# EasyEDA Pro project 平衡车主板.eprj, schematic Schematic1
Board Name: Board1; Create Date: 2025-03-17; Company: 自动化科协; Drawed: Mr_Pian; Reviewed: Mr_Pian
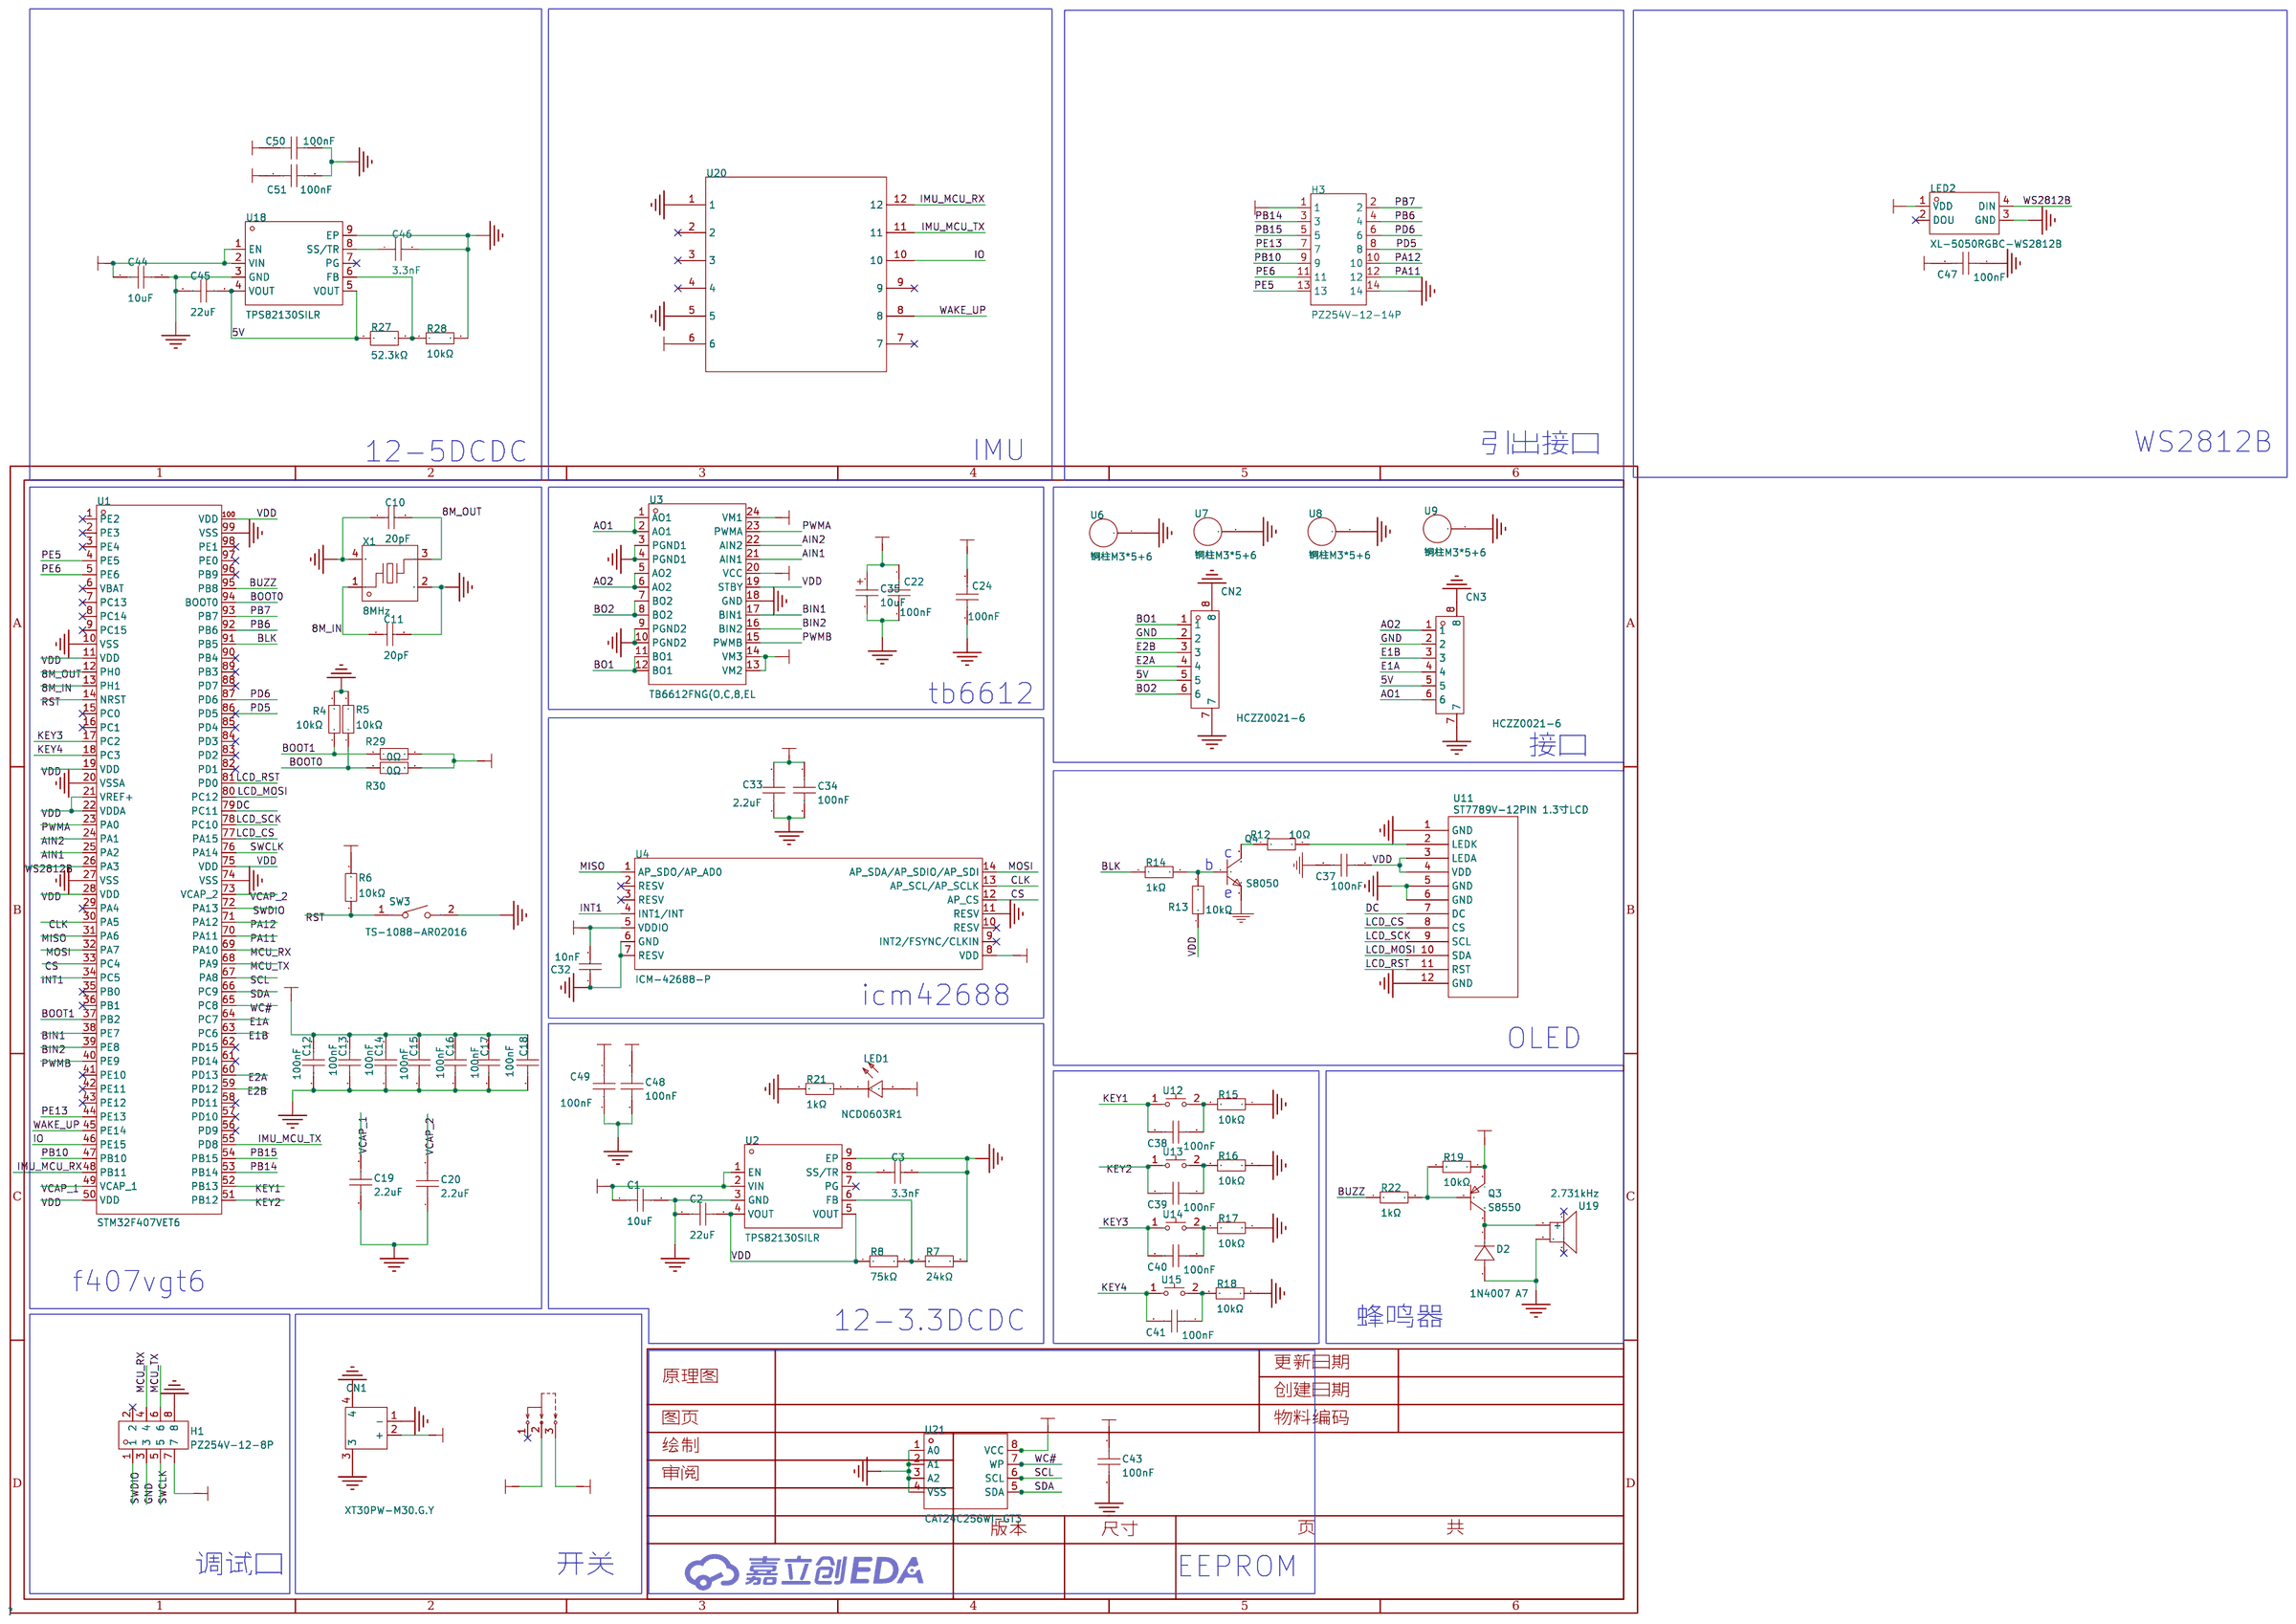
[diagram p0: schematic sheet]

## Parts
C1  10uF  [C0805]
C2  22uF  [C0805]
C3  3.3nF  [C0603]
C10  20pF  [C0603]
C11  20pF  [C0603]
C12  100nF  [C0603]
C13  100nF  [C0603]
C14  100nF  [C0603]
C15  100nF  [C0603]
C16  100nF  [C0603]
C17  100nF  [C0603]
C18  100nF  [C0603]
C19  2.2uF  [C0603]
C20  2.2uF  [C0603]
C22  100nF  [C0603]
C24  100nF  [C0603]
C32  10nF  [C0603]
C33  2.2uF  [C0603]
C34  100nF  [C0603]
C35  10uF  [CAP-SMD_L3.2-W1.6-RD-C7171]
C37  100nF  [C0603]
C38  100nF  [C0603]
C39  100nF  [C0603]
C40  100nF  [C0603]
C41  100nF  [C0603]
C43  100nF  [C0603]
C44  10uF  [C0805]
C45  22uF  [C0805]
C46  3.3nF  [C0603]
C47  100nF  [C0603]
C48  100nF  [C0603]
C49  100nF  [C0603]
C50  100nF  [C0603]
C51  100nF  [C0603]
CN1  XT30PW-M30.G.Y  [CONN-TH_XT30PW-M]
CN2  HCZZ0021-6  [CONN-SMD_HCZZ0021-6]
CN3  HCZZ0021-6  [CONN-SMD_HCZZ0021-6]
D2  1N4007 A7  [SOD-123FL_L2.8-W1.8-LS3.7-RD]
H1  PZ254V-12-8P  [HDR-TH_8P-P2.54-V-M-R2-C4-S2.54]
H3  PZ254V-12-14P  [HDR-TH_14P-P2.54-V-M-R2-C7-S2.54]
LED1  NCD0603R1  [LED0603-RD]
LED2  XL-5050RGBC-WS2812B  [LED-SMD_4P-L5.0-W5.0-BL_XL-5050RGBC]
Q3  S8550  [SOT-23-3_L2.9-W1.6-P1.90-LS2.8-BR]
Q4  S8050  [SOT-23-3_L2.9-W1.3-P1.90-LS2.3-BR]
R4  10kΩ  [R0603]
R5  10kΩ  [R0603]
R6  10kΩ  [R0603]
R7  24kΩ  [R0603]
R8  75kΩ  [R0603]
R12  10Ω  [R0603]
R13  10kΩ  [R0603]
R14  1kΩ  [R0603]
R15  10kΩ  [R0603]
R16  10kΩ  [R0603]
R17  10kΩ  [R0603]
R18  10kΩ  [R0603]
R19  10kΩ  [R0603]
R21  1kΩ  [R0603]
R22  1kΩ  [R0603]
R27  52.3kΩ  [R0603]
R28  10kΩ  [R0603]
R29  0Ω  [R0603]
R30  0Ω  [R0603]
SW3  TS-1088-AR02016  [SW-SMD_L3.9-W3.0-P4.45]
U1  STM32F407VET6  [LQFP-100_L14.0-W14.0-P0.50-LS16.0-BL]
U2  TPS82130SILR  [USIP-8_L3.0-W2.8-P0.65-TL-EP]
U3  TB6612FNG(O,C,8,EL  [SSOP-24_L8.4-W5.8-P0.65-LS7.8-BL]
U4  ICM-42688-P  [LGA-14_L3.0-W2.5-P0.50-TL]
U6  铜柱M3*5+6  [SMD_BD4.2-L4.7-W4.7-D3.0]
U7  铜柱M3*5+6  [SMD_BD4.2-L4.7-W4.7-D3.0]
U8  铜柱M3*5+6  [SMD_BD4.2-L4.7-W4.7-D3.0]
U9  铜柱M3*5+6  [SMD_BD4.2-L4.7-W4.7-D3.0]
U11  ST7789V-12PIN 1.3寸LCD  [ST7789V-12PIN]
U12  TS-1199A26050  [SW-SMD_L6.0-W6.0-LS6.6]
U13  TS-1199A26050  [SW-SMD_L6.0-W6.0-LS6.6]
U14  TS-1199A26050  [SW-SMD_L6.0-W6.0-LS6.6]
U15  TS-1199A26050  [SW-SMD_L6.0-W6.0-LS6.6]
U16  SS12D10G5  [SW-TH_SHOU-HAN_SS12D10G4]
U18  TPS82130SILR  [USIP-8_L3.0-W2.8-P0.65-TL-EP]
U19  2.731kHz  [BUZ-SMD_4P-L8.5-W8.5-P8.50-TL-A]
U20  -  [15轴imu]
U21  CAT24C256WI-GT3  [SOIC-8_L4.9-W3.9-P1.27-LS6.0-BL]
X1  8MHz  [OSC-SMD_4P-L3.2-W2.5-BL]

## Library data of the parts
C1 C44 = GRM21BR61H106KE43L: 容值:10uF;精度:±10%;额定电压:50V;材质(温度系数):X5R;; LCSC Part Name: 10uF ±10% 50V; Supplier Part: C440198; Manufacturer: muRata(村田); Supplier Footprint: 0805; JLCPCB Part Class: 基础库; Datasheet: https://atta.szlcsc.com/upload/public/pdf/source/20230811/95AAE0C9AF55EDC31B7A4D8B733F534E.pdf; Supplier: LCSC; Tolerance: ±10%; Voltage Rated: 50V; Temperature Coefficient: X5R
C2 C45 = CGA0805X5R226M350MT: 容值:22uF;精度:±20%;额定电压:35V;材质(温度系数):X5R;; LCSC Part Name: 22uF ±20% 35V; Supplier Part: C6119901; Manufacturer: HRE(芯声); Supplier Footprint: 0805; JLCPCB Part Class: 扩展库; Datasheet: https://atta.szlcsc.com/upload/public/pdf/source/20231129/D589D0CC4D260F7AC3A77E53B455CCB3.pdf; Supplier: LCSC; Tolerance: ±20%; Voltage Rated: 35V; Temperature Coefficient: X5R
C3 C46 = CC0603KRX7R9BB332: 容值:3.3nF;精度:±10%;额定电压:50V;材质(温度系数):X7R;; LCSC Part Name: 3.3nF ±10% 50V; Supplier Part: C107088; Manufacturer: YAGEO(国巨); Supplier Footprint: 0603; JLCPCB Part Class: 扩展库; Datasheet: https://atta.szlcsc.com/upload/public/pdf/source/20180910/C282072_33301C7F631E79921B82A8DAC6BCC5B3.pdf; Supplier: LCSC; Tolerance: ±10%; Voltage Rated: 50V; Temperature Coefficient: X7R
C10 C11 = CL10C200JB8NNNC: 容值:20pF;精度:±5%;额定电压:50V;材质(温度系数):C0G;; LCSC Part Name: 20pF ±5% 50V; Supplier Part: C1648; Manufacturer: SAMSUNG(三星); Supplier Footprint: 0603; JLCPCB Part Class: 基础库; Datasheet: https://atta.szlcsc.com/upload/public/pdf/source/20160218/1457707763339.pdf; Supplier: LCSC; Tolerance: ±5%; Voltage Rated: 50V; Temperature Coefficient: C0G
C12-C18 C22 C24 C34 C37-C41 C43 C47-C51 = CGA0603X7R104K500JT: 容值:100nF;精度:±10%;额定电压:50V;材质(温度系数):X7R;; LCSC Part Name: 100nF ±10% 50V; Supplier Part: C6119867; Manufacturer: HRE(芯声); Supplier Footprint: 0603; JLCPCB Part Class: 扩展库; Supplier: LCSC; Tolerance: ±10%; Voltage Rated: 50V; Temperature Coefficient: X7R
C19 C20 C33 = CL10A225KB8NNNC: 容值:2.2uF;精度:±10%;额定电压:50V;材质(温度系数):X5R;; LCSC Part Name: 2.2uF ±10% 50V; Supplier Part: C913904; Manufacturer: SAMSUNG(三星); Supplier Footprint: 0603; JLCPCB Part Class: 扩展库; Datasheet: https://atta.szlcsc.com/upload/public/pdf/source/20160218/1457707763339.pdf; Supplier: LCSC; Tolerance: ±10%; Voltage Rated: 50V; Temperature Coefficient: X5R
C32 = CC0603KRX7R9BB103: 容值:10nF;精度:±10%;额定电压:50V;材质(温度系数):X7R;; LCSC Part Name: 10nF ±10% 50V; Supplier Part: C100042; Manufacturer: YAGEO(国巨); Supplier Footprint: 0603; JLCPCB Part Class: 扩展库; Datasheet: https://atta.szlcsc.com/upload/public/pdf/source/20181008/C309510_22F155564471FAF6A489F7D68F34234E.pdf; Supplier: LCSC; Tolerance: ±10%; Voltage Rated: 50V; Temperature Coefficient: X7R
C35 = TAJA106K016RNJ: 容值:10uF;精度:±10%;额定电压:16V;等效串联电阻:3Ω@100kHz;; LCSC Part Name: 10uF ±10% 16V; Supplier Part: C7171; Manufacturer: Kyocera AVX; Supplier Footprint: CASE-A-3216; JLCPCB Part Class: 基础库; Datasheet: https://atta.szlcsc.com/upload/public/pdf/source/20160107/1457707750344.pdf; Supplier: LCSC; Tolerance: ±10%; Rated Voltage: 16V; Equivalent Series Resistance(ESR): 3Ω@100kHz; Operating Temperature: -55℃~+125℃
CN1 = XT30PW-M30.G.Y: 类别:-;类型1:-;; LCSC Part Name: AMASS(艾迈斯)航模插头 卧式弯脚 XT30PW-M公头; Supplier Part: C431092; Manufacturer: AMASS(艾迈斯); JLCPCB Part Class: 扩展库; Datasheet: https://atta.szlcsc.com/upload/public/pdf/source/20220222/6A9F22F7850E25B33E1BE430ADF8560B.pdf; Supplier: LCSC; Type: 航模插头; RatedVoltage: DC 500V; InterfaceType: 公头; RatedCurrent: 15A; RecommendedWireGauge: 16/18/20AWG; contact resistance: 1.2mΩ; specifications: 2pin
CN2 CN3 = HCZZ0021-6: 插针结构:1x6P;间距:2.5mm;安装方式:卧贴;参考系列:XH;总PIN数:6P;排数:1;每排PIN数:6;行距:-;额定电流:3A;触头材质:铜;触头镀层:锡;工作温度范围:-25℃~+85℃;; LCSC Part Name: 米色 1x6P 间距:2.5mm 卧贴 系列:XH; Supplier Part: C7433711; Manufacturer: HC(虹成电子); Supplier Footprint: SMD,P=2.54mm,卧贴; JLCPCB Part Class: 扩展库; Datasheet: https://atta.szlcsc.com/upload/public/pdf/source/20250106/A1AC4F19854231991FFD8DC63F8FCB5E.pdf; Supplier: LCSC; Pins Structure: 1x6P; Pitch: 2.5mm; Mounting Type: 卧贴; Reference Series: XH; Number of Pins: 6P; Number of Rows: 1; Number of PINs Per Row: 6; Current Rating: 3A; Contact Material: 铜; Contact Plating: 锡; Operating Temperature: -25℃~+85℃; Voltage Rating: 250V; Plastic Material: LCP; Color: 米色; Z-Height of the Board: 6mm; X-Length of Bottom Edge on Board (Spacing Line): 20mm; Y-Width of Bottom Edge on Board: 10.6mm
D2 = 1N4007 A7: 二极管配置:-;正向压降(Vf):1V@1A;直流反向耐压(Vr):1kV;整流电流:1A;; LCSC Part Name: 电压:1kV 电流:1A; Supplier Part: C2902912; Manufacturer: MSKSEMI(美森科); Supplier Footprint: SOD-123FL; JLCPCB Part Class: 扩展库; Datasheet: https://atta.szlcsc.com/upload/public/pdf/source/20240508/1829C9D8507EFBB572682FFAB90585C9.pdf; Supplier: LCSC; Forward Voltage (Vf@If): 1V@1A; Reverse Voltage (Vr): 1kV; Rectified Current: 1A; Reverse Leakage Current: 10uA@1kV
H1 = PZ254V-12-8P: 插针结构:2x4P;间距:2.54mm;行距:2.54mm;圆针/方针:方针;安装类型:直插;排数:双排;总PIN位数:8P;额定电流:-;额定电压:-;配合针长度:6mm;塑高:2.5mm;端接针长度:3mm;触头材质:黄铜;触头镀层:-;工作温度范围:-40℃~+105℃;颜色:黑色;; LCSC Part Name: 间距:2.54mm 2x4P 直插 方针; Supplier Part: C492421; Manufacturer: XFCN(兴飞); Supplier Footprint: 插件,P=2.54mm; JLCPCB Part Class: 扩展库; Datasheet: https://atta.szlcsc.com/upload/public/pdf/source/20200309/C492421_DC8A206AF99CD7755BD4A5B0BC48200B.pdf; Supplier: LCSC; Pin Structure: 2x4P; Pitch: 2.54mm; Row Spacing: 2.54mm; Circluar Pins/Square Pins: 方针; Mounting Type: 直插; Number of Rows: 双排; Number of Pins: 8P; Length of Mating Pin: 6mm; Insulation Height: 2.5mm; Length of End Connection Pin: 3mm; Contact Material: 黄铜; Operating Temperature Range: -40℃~+105℃; Color: 黑色
H3 = PZ254V-12-14P: LCSC Part Name: 2x7P 间距:2.54mm 方针 直插; Supplier Part: C492424; Manufacturer: XFCN(兴飞); Supplier Footprint: 插件,P=2.54mm; JLCPCB Part Class: 扩展库; Datasheet: https://atta.szlcsc.com/upload/public/pdf/source/20200309/C492424_D71F2B7B4151908BA6AE7E1F567EA536.pdf; Supplier: LCSC; Pin Structure: 2x7P; Pitch: 2.54mm; Row Spacing: 2.54mm; Circluar Pins/Square Pins: 方针; Mounting Type: 直插; Number of Rows: 双排; Number of Pins: 14P; Length of Mating Pin: 6mm; Insulation Height: 2.5mm; Length of End Connection Pin: 3mm; Contact Material: 黄铜; Operating Temperature: -40℃~+105℃; Color: 黑色
LED1 = NCD0603R1_C84263: Supplier Part: C84263; Manufacturer: 国星光电; Supplier Footprint: 0603; JLCPCB Part Class: 扩展库; Datasheet: https://atta.szlcsc.com/upload/public/pdf/source/20200820/C84263_DABC6A75E58F576973B407FDBA283D60.pdf; Supplier: LCSC; Emitted Color: 红色; Forward Voltage (VF): 1.6V~2.6V; Power Dissipation: 65mW; Forward Current: 20mA; Dominant Wavelength: 615nm~630nm; Diode Configuration: 独立二极管; Lens Color: 无色透明透镜; Luminous Intensity: 80mcd~220mcd; Viewing Angle: 130°; Operating Temperature: -30℃~+85℃
LED2 = XL-5050RGBC-WS2812B: 5050七彩幻彩透明贴片LED灯珠 5050 幻彩透明四脚 ws2812B 内置驱动IC; Supplier Part: C2843785; Manufacturer: XINGLIGHT(成兴光); Supplier Footprint: SMD5050; JLCPCB Part Class: 扩展库; Datasheet: https://atta.szlcsc.com/upload/public/pdf/source/20240412/E1004CAA80592E31D08BFE019083806F.pdf; Supplier: LCSC
Q3 = S8550_C181159: 晶体管类型:PNP;集电极电流(Ic):500mA;集射极击穿电压(Vceo):25V;功率(Pd):300mW;; LCSC Part Name: PNP 电流:500mA 耐压:25V; Supplier Part: C181159; Manufacturer: Hottech(合科泰); Supplier Footprint: SOT-23; JLCPCB Part Class: 扩展库; Datasheet: https://atta.szlcsc.com/upload/public/pdf/source/20220506/DB226E6DCB1B20BD416878FDC9C7258D.pdf; Supplier: LCSC; Transistor Type: PNP; Collector Current (Ic): 500mA; Collector-Emitter Breakdown Voltage (Vceo): 25V; Power Dissipation (Pd): 300mW; Transition Frequency (fT): 150MHz; Collector Cut-Off Current (Icbo): 100nA; Collector-Emitter Saturation Voltage (VCE(sat)@Ic,Ib): 600mV@500mA,50mA
Q4 = S8050_C20069125: 晶体管类型:NPN;集电极电流(Ic):500mA;集射极击穿电压(Vceo):25V;功率(Pd):300mW;直流电流增益(hFE@Ic,Vce):120@50mA,1.0V;; LCSC Part Name: hFE:200-350，丝印:J3Y; Supplier Part: C20069125; Manufacturer: 宏迦橙; Supplier Footprint: SOT-23; JLCPCB Part Class: Extended Part; Datasheet: https://atta.szlcsc.com/upload/public/pdf/source/20240403/2D78449C96B6E27F13BF8BDF79E27159.pdf; Supplier: LCSC; Transistor Type: NPN; Collector Current (Ic): 500mA; Collector-Emitter Breakdown Voltage (Vceo): 25V; Power Dissipation (Pd): 300mW; DC Current Gain (hFE@Ic,Vce): 120@50mA,1.0V; Transition Frequency (fT): 100MHz; Collector Cut-Off Current (Icbo): 100nA; Collector-Emitter Saturation Voltage (VCE(sat)@Ic,Ib): 600mV@500mA,50mA; Operating Temperature: -55℃~+150℃
R4-R6 R13 R15-R19 R28 = 0603WAF1002T5E: 电阻类型:厚膜电阻;阻值:10kΩ;精度:±1%;功率:100mW;最大工作电压:75V;温度系数:±100ppm/℃;; LCSC Part Name: 厚膜电阻 10kΩ ±1% 100mW; Supplier Part: C25804; Manufacturer: UNI-ROYAL(厚声); Supplier Footprint: 0603; JLCPCB Part Class: 基础库; Datasheet: https://atta.szlcsc.com/upload/public/pdf/source/20200306/C422600_1E6D84923E4A46A82E41ADD87F860B5C.pdf; Supplier: LCSC; Type: 厚膜电阻; Tolerance: ±1%; Power(Watts): 100mW; Overload Voltage (Max): 75V; Temperature Coefficient: ±100ppm/℃; Operating Temperature Range: -55℃~+155℃
R7 = 0603WAF2402T5E: 电阻类型:厚膜电阻;阻值:24kΩ;精度:±1%;功率:100mW;最大工作电压:75V;温度系数:±100ppm/℃;; LCSC Part Name: 24kΩ ±1% 100mW 厚膜电阻; Supplier Part: C23352; Manufacturer: UNI-ROYAL(厚声); Supplier Footprint: 0603; JLCPCB Part Class: 基础库; Datasheet: https://atta.szlcsc.com/upload/public/pdf/source/20200306/C422600_1E6D84923E4A46A82E41ADD87F860B5C.pdf; Supplier: LCSC; Type: 厚膜电阻; Tolerance: ±1%; Power(Watts): 100mW; Overload Voltage (Max): 75V; Temperature Coefficient: ±100ppm/℃; Operating Temperature Range: -55℃~+155℃
R8 = 0603WAF7502T5E: 电阻类型:厚膜电阻;阻值:75kΩ;精度:±1%;功率:100mW;最大工作电压:75V;温度系数:±100ppm/℃;; LCSC Part Name: 75kΩ ±1% 100mW 厚膜电阻; Supplier Part: C23242; Manufacturer: UNI-ROYAL(厚声); Supplier Footprint: 0603; JLCPCB Part Class: Basic Part; Datasheet: https://atta.szlcsc.com/upload/public/pdf/source/20200306/C422600_1E6D84923E4A46A82E41ADD87F860B5C.pdf; Supplier: LCSC; Type: 厚膜电阻; Tolerance: ±1%; Power(Watts): 100mW; Overload Voltage (Max): 75V; Temperature Coefficient: ±100ppm/℃; Operating Temperature Range: -55℃~+155℃
R12 = 0603WAF100JT5E: 电阻类型:厚膜电阻;阻值:10Ω;精度:±1%;功率:100mW;最大工作电压:75V;温度系数:±400ppm/℃;; LCSC Part Name: 10Ω ±1% 100mW 厚膜电阻; Supplier Part: C22859; Manufacturer: UNI-ROYAL(厚声); Supplier Footprint: 0603; JLCPCB Part Class: 基础库; Datasheet: https://atta.szlcsc.com/upload/public/pdf/source/20200306/C422600_1E6D84923E4A46A82E41ADD87F860B5C.pdf; Supplier: LCSC; Type: 厚膜电阻; Tolerance: ±1%; Power(Watts): 100mW; Overload Voltage (Max): 75V; Temperature Coefficient: ±400ppm/℃; Operating Temperature Range: -55℃~+155℃
R14 R21 R22 = 0603WAF1001T5E: 电阻类型:厚膜电阻;阻值:1kΩ;精度:±1%;功率:100mW;最大工作电压:75V;温度系数:±100ppm/℃;; LCSC Part Name: 1kΩ ±1% 100mW 厚膜电阻; Supplier Part: C21190; Manufacturer: UNI-ROYAL(厚声); Supplier Footprint: 0603; JLCPCB Part Class: 基础库; Datasheet: https://atta.szlcsc.com/upload/public/pdf/source/20200306/C422600_1E6D84923E4A46A82E41ADD87F860B5C.pdf; Supplier: LCSC; Type: 厚膜电阻; Tolerance: ±1%; Power(Watts): 100mW; Overload Voltage (Max): 75V; Temperature Coefficient: ±100ppm/℃; Operating Temperature Range: -55℃~+155℃
R27 = ERA3AEB5232V: 电阻类型:薄膜电阻;阻值:52.3kΩ;精度:±0.1%;功率:100mW;最大工作电压:75V;温度系数:±25ppm/℃;; LCSC Part Name: 52.3kΩ ±0.1% 100mW 薄膜电阻; Supplier Part: C491140; Manufacturer: PANASONIC(松下); Supplier Footprint: 0603; JLCPCB Part Class: 扩展库; Datasheet: https://atta.szlcsc.com/upload/public/pdf/source/20200407/C491140_32D6B0B19854D031AFB813DB9EBD0395.pdf; Supplier: LCSC; Type: 薄膜电阻; Tolerance: ±0.1%; Power(Watts): 100mW; Overload Voltage (Max): 75V; Temperature Coefficient: ±25ppm/℃; Operating Temperature Range: -55℃~+155℃
R29 R30 = 0603WAF0000T5E: 电阻类型:厚膜电阻;阻值:0Ω;精度:±1%;功率:100mW;最大工作电压:75V;; LCSC Part Name: 0Ω ±1% 100mW 厚膜电阻; Supplier Part: C21189; Manufacturer: UNI-ROYAL(厚声); Supplier Footprint: 0603; JLCPCB Part Class: 基础库; Datasheet: https://atta.szlcsc.com/upload/public/pdf/source/20200306/C422600_1E6D84923E4A46A82E41ADD87F860B5C.pdf; Supplier: LCSC; Type: 厚膜电阻; Tolerance: ±1%; Power(Watts): 100mW; Overload Voltage (Max): 75V; Operating Temperature Range: -55℃~+155℃
SW3 = TS-1088-AR02016: 电路结构:单刀单掷;按钮形状:圆形按钮;作用力:160gf;安装方式:立贴;开关长度:4mm;开关宽度:3mm;开关高度:2mm;带支架:不带;触点电流:50mA;额定电压(DC):12V;绝缘电阻:100MΩ;机械寿命:10万次;; LCSC Part Name: 4*3*2mm 立贴 轻触开关; Supplier Part: C720477; Manufacturer: XUNPU(讯普); Supplier Footprint: SMD; JLCPCB Part Class: 扩展库; Datasheet: https://atta.szlcsc.com/upload/public/pdf/source/20200810/C720475_60D09DD6C54279ADDB2DC25100F1CC11.pdf; Supplier: LCSC; Circuit: 单刀单掷; Actuator Style: 圆形按钮; Operating Force: 160gf; Mounting Style: 立贴; Switch Length: 4mm; Switch Width: 3mm; Switch Height: 2mm; Strike Gundam: 不带; Contact Current: 50mA; Voltage Rating (DC): 12V; Insulation Resistance: 100MΩ; Actuator/Cap Color: 黑色; Pin Style: SMD接片; Mechanical Life: 10万次; Operating Temperature: -30℃~+80℃
U1 = STM32F407VGT6: CPU内核:ARM-M4;程序存储容量:1MB;RAM总容量:192KB;GPIO端口数量:82;工作电压范围:1.8V~3.6V;CPU最大主频:168MHz;程序存储器类型:FLASH;; LCSC Part Name: 带DSP和FPU的高性能基础系列ARM Cortex-M4 MCU，具有1 MB Flash、168 MHz CPU、ART加速器、以太网和FSMC; Supplier Part: C12345; Manufacturer: ST(意法半导体); Supplier Footprint: LQFP-100(14x14); JLCPCB Part Class: 扩展库; Datasheet: https://atta.szlcsc.com/upload/public/pdf/source/20201130/C919362_39400D478C258148B3DF984CE4A4041A.pdf; Supplier: LCSC; CPU Core: ARM-M4; Program Storage Size: 1MB; RAM Size: 192KB; GPIO Ports Number: 82; Operating Voltage Range: 1.8V~3.6V; CPU Maximum Speed: 168MHz; Program Memory Type: FLASH; Operating Temperature Range: -40℃~+85℃; ADC (Bit): 12bit; DAC (Bit): 12bit; Universal Serial Bus: 有; Peripheral/Function: DMA；LCD/LED驱动; Watchdog: 有; Infrared Data Association: 有; Low-Voltage Detect: 有; LCD Module: 有; Direct Memory Access: 有; Internal Oscillator: 有
U2 U18 = TPS82130SILR: TPS82130 TPS82130 具有集成电感的 3A 17V 降压转换器; Supplier Part: C473914; Manufacturer: TI(德州仪器); Supplier Footprint: USIP-8; JLCPCB Part Class: 扩展库; Datasheet: https://www.ti.com/cn/lit/gpn/tps82130; Supplier: LCSC
U3 = TB6612FNG(O,C,8,EL: 双直流电机驱动器集成电路; Supplier Part: C88224; Manufacturer: TOSHIBA(东芝); Supplier Footprint: SSOP-24-208mil; JLCPCB Part Class: 扩展库; Datasheet: https://atta.szlcsc.com/upload/public/pdf/source/20171128/C141517_15118625624231147036.pdf; Supplier: LCSC
U4 = ICM-42688-P: 传感器类型:加速度计陀螺仪;; Supplier Part: C1850418; Manufacturer: TDK InvenSense(应美盛); Supplier Footprint: LGA-14(2.5x3); JLCPCB Part Class: 扩展库; Datasheet: https://atta.szlcsc.com/upload/public/pdf/source/20210703/CF24204867ACE5B754A2B035F23E5931.pdf; Supplier: LCSC; Sensor Type: 加速度计陀螺仪
U6-U9 = 铜柱M3*5+6: M3*5+6; LCSC Part Name: 国产 铜柱M3*5+6 铜柱M3*5+6; Supplier Part: C87703; Manufacturer: 国产; JLCPCB Part Class: 扩展库; Supplier: LCSC
U11 = ST7789V-12PIN 1.3寸LCD: link: https://item.taobao.com/item.htm?spm=a1z09.2.0.0.223f2e8dx10dqp&amp;id=565306950948&amp;_u=o1u069vf46a
U12-U15 = TS-1199A26050: LCSC Part Name: 停产 6X6X5硅胶按键开关 260力度; Supplier Part: C7471808; Manufacturer: HanElectricity(瀚源); JLCPCB Part Class: 扩展库; Datasheet: https://atta.szlcsc.com/upload/public/pdf/source/20230804/DBC2CAE0DF05289A0977E10084746426.pdf; Supplier: LCSC
U16 = SS12D10G5: 电路结构:单刀双掷;安装方式:直插;额定电流(DC):2A;额定电压(DC):125V;机械寿命:3千次;; LCSC Part Name: 两档立式插件 3脚拨动开关 柄长5.0mm; Supplier Part: C7431054; Manufacturer: SHOU HAN(首韩); Supplier Footprint: 插件; JLCPCB Part Class: 扩展库; Datasheet: https://atta.szlcsc.com/upload/public/pdf/source/20231130/7A3DB6A149BF0A1DCFFE64FFC07FE434.pdf; Supplier: LCSC; Circuit: 单刀双掷; Switch Length: 12.7mm; Switch Width: 6.7mm; Mounting Style: 直插; Current Rating (DC): 2A; Voltage Rating (DC): 125V; Mechanical Life: 3千次; Operating Temperature: -25℃~+70℃
U19 = HYG-8503A-5027: LCSC Part Name: 贴片无源蜂鸣器HYG-8503A-5027 5V; Supplier Part: C18623826; Manufacturer: HYDZ(华宇); Supplier Footprint: SMD; JLCPCB Part Class: 扩展库; Datasheet: https://atta.szlcsc.com/upload/public/pdf/source/20231017/D57FB0546E64A4EBF5DB0930122F3B47.pdf; Supplier: LCSC; Current Consumption: 90mA; Sound Pressure Level(SPL): 85dB
U20 = 15轴imu
U21 = CAT24C256WI-GT3: LCSC Part Name: EEPROM 串行 256-Kb I2C; Supplier Part: C79987; Manufacturer: onsemi(安森美); Supplier Footprint: SOIC-8; JLCPCB Part Class: Extended Part; Datasheet: https://atta.szlcsc.com/upload/public/pdf/source/20180125/C146734_15168615717981301674.pdf; Supplier: LCSC; Interface Type: I2C; Memory Size: 256Kbit; Supply Voltage: 1.8V~5.5V; Operating Temperature: -40℃~+85℃
X1 = X32258MOB4SI: 晶振类型:贴片晶振;频率:8MHz;常温频差:±10ppm;外接负载电容:12pF;频率稳定度(全温):±20ppm;; LCSC Part Name: 8MHz ±10ppm 12pF; Supplier Part: C2682775; Manufacturer: YXC(扬兴晶振); Supplier Footprint: SMD3225-4P; JLCPCB Part Class: 扩展库; Datasheet: https://atta.szlcsc.com/upload/public/pdf/source/20240329/19D5F850207469550BEB00D7DFEDBC7A.pdf; Supplier: LCSC; Crystal Type: 贴片晶振; Normal temperature Frequency Tolerance: ±10ppm; External load capacitor: 12pF; Frequency Stability(Full temperature range): ±20ppm; Equivalent Series Resistance (ESR): 150Ω; Operating Temperature: -40℃~+85℃

## Nets
5V: C45.2 C47.2 C50.1 CN2.5 CN3.5 H3.1 LED2.1(VDD) Q3.2(E) R19.1 R27.1 U18.4(VOUT) U18.5(VOUT) U20.6
12.6V: C1.1 C22.1 C35.1 C44.1 C49.1 C51.1 U2.1(EN) U2.2(VIN) U3.13(VM2) U3.14(VM3) U3.24(VM1) U16.2 U18.1(EN) U18.2(VIN)
12.6V_IN: CN1.2(+) U16.3
GND: C1.2 C2.1 C3.2 C10.1 C11.2 C12.1 C13.1 C14.1 C15.1 C16.1 C17.1 C18.1 C19.1 C20.1 C22.2 C24.2 C32.1 C33.1 C34.1 C35.2 C37.2 C43.2 C44.2 C45.1 C46.2 C47.1 C48.2 C49.2 C50.2 C51.2 CN1.1(-) CN1.3 CN1.4 CN2.2 CN2.7 CN2.8 CN3.2 CN3.7 CN3.8 D2.2(A) H1.3 H1.8 H3.14 LED2.3(GND) Q4.2(E) R4.2 R5.2 R7.2 R15.1 R16.1 R17.1 R18.1 R21.1 R28.2 SW3.2 U1.10(VSS) U1.20(VSSA) U1.27(VSS) U1.74(VSS) U1.99(VSS) U2.3(GND) U2.9(EP) U3.3(PGND1) U3.4(PGND1) U3.9(PGND2) U3.10(PGND2) U3.18(GND) U4.6(GND) U4.7(RESV) U4.11(RESV) U6.1 U7.1 U8.1 U9.1 U11.1(GND) U11.5(GND) U11.6(GND) U11.12(GND) U18.3(GND) U18.9(EP) U19.2 U20.1 U20.5 U21.1(A0) U21.2(A1) U21.3(A2) U21.4(VSS) X1.2(GND) X1.4(GND)
VDD: C2.2 C12.2 C13.2 C14.2 C15.2 C16.2 C17.2 C18.2 C24.1 C32.2 C33.2 C34.2 C37.1 C43.1 C48.1 H1.7 LED1.2(A) R6.2 R8.1 R13.1 R29.2 R30.2 U1.11(VDD) U1.19(VDD) U1.21(VREF+) U1.22(VDDA) U1.28(VDD) U1.50(VDD) U1.75(VDD) U1.100(VDD) U2.4(VOUT) U2.5(VOUT) U3.19(STBY) U3.20(VCC) U4.5(VDDIO) U4.8(VDD) U11.3(LEDA) U11.4(VDD) U21.8(VCC)
8M_IN: C11.1 U1.13(PH1) X1.1
8M_OUT: C10.2 U1.12(PH0) X1.3
AIN1: U1.25(PA2) U3.21(AIN1)
AIN2: U1.24(PA1) U3.22(AIN2)
AO1: CN3.6 U3.1(AO1) U3.2(AO1)
AO2: CN3.1 U3.5(AO2) U3.6(AO2)
BIN1: U1.38(PE7) U3.17(BIN1)
BIN2: U1.39(PE8) U3.16(BIN2)
BLK: R14.1 U1.91(PB5)
BO1: CN2.1 U3.11(BO1) U3.12(BO1)
BO2: CN2.6 U3.7(BO2) U3.8(BO2)
BOOT0: R5.1 R30.1 U1.94(BOOT0)
BOOT1: R4.1 R29.1 U1.37(PB2)
BUZZ: R22.1 U1.95(PB8)
CLK: U1.30(PA5) U4.13(AP_SCL/AP_SCLK)
CS: U1.33(PC4) U4.12(AP_CS)
DC: U1.79(PC11) U11.7(DC)
E1A: CN3.4 U1.64(PC7)
E1B: CN3.3 U1.63(PC6)
E2A: CN2.4 U1.60(PD13)
E2B: CN2.3 U1.59(PD12)
IMU_MCU_RX: U1.48(PB11) U20.12
IMU_MCU_TX: U1.55(PD8) U20.11
INT1: U1.34(PC5) U4.4(INT1/INT)
IO: U1.46(PE15) U20.10
KEY1: C38.2 U1.52(PB13) U12.1
KEY2: C39.2 U1.51(PB12) U13.1
KEY3: C40.2 U1.17(PC2) U14.1
KEY4: C41.2 U1.18(PC3) U15.1
LCD_CS: U1.77(PA15) U11.8(CS)
LCD_MOSI: U1.80(PC12) U11.10(SDA)
LCD_RST: U1.81(PD0) U11.11(RST)
LCD_SCK: U1.78(PC10) U11.9(SCL)
MCU_RX: H1.4 U1.69(PA10)
MCU_TX: H1.6 U1.68(PA9)
MISO: U1.31(PA6) U4.1(AP_SDO/AP_AD0)
MOSI: U1.32(PA7) U4.14(AP_SDA/AP_SDIO/AP_SDI)
PA11: H3.12 U1.70(PA11)
PA12: H3.10 U1.71(PA12)
PB6: H3.4 U1.92(PB6)
PB7: H3.2 U1.93(PB7)
PB10: H3.9 U1.47(PB10)
PB14: H3.3 U1.53(PB14)
PB15: H3.5 U1.54(PB15)
PD5: H3.8 U1.86(PD5)
PD6: H3.6 U1.87(PD6)
PE5: H3.13 U1.4(PE5)
PE6: H3.11 U1.5(PE6)
PE13: H3.7 U1.44(PE13)
PWMA: U1.23(PA0) U3.23(PWMA)
PWMB: U1.40(PE9) U3.15(PWMB)
RST: R6.1 SW3.1 U1.14(NRST)
SCL: U1.67(PA8) U21.6(SCL)
SDA: U1.66(PC9) U21.5(SDA)
SWCLK: H1.5 U1.76(PA14)
SWDIO: H1.1 U1.72(PA13)
VCAP_1: C19.2 U1.49(VCAP_1)
VCAP_2: C20.2 U1.73(VCAP_2)
WAKE_UP: U1.45(PE14) U20.8
WC#: U1.65(PC8) U21.7(WP)
WS2812B: LED2.4(DIN) U1.26(PA3)
$1N2697: C3.1 U2.8(SS/TR)
$1N2951: R7.1 R8.2 U2.6(FB)
$1N16688: Q4.1(B) R13.2 R14.2
$1N16689: R12.2 U11.2(LEDK)
$1N16699: Q4.3(C) R12.1
$1N17448: C38.1 R15.2 U12.2
$1N17624: C39.1 R16.2 U13.2
$1N17748: C40.1 R17.2 U14.2
$1N17872: C41.1 R18.2 U15.2
$1N18033: D2.1(K) Q3.3(C) U19.1(+)
$1N18088: Q3.1(B) R19.2 R22.2
$1N32190: C46.1 U18.8(SS/TR)
$1N32192: R27.2 R28.1 U18.6(FB)
$1N54508: LED1.1(K) R21.2

Not connected (* = marked no-connect by the designer): H1 2*; LED2 2(DOU)*; U1 1(PE2)* 2(PE3)* 3(PE4)* 6(VBAT)* 7(PC13)* 8(PC14)* 9(PC15)* 15(PC0)* 16(PC1)* 29(PA4)* 35(PB0)* 36(PB1)* 41(PE10)* 42(PE11)* 43(PE12)* 56(PD9)* 57(PD10)* 58(PD11)* 61(PD14)* 62(PD15)* 82(PD1)* 83(PD2)* 84(PD3)* 85(PD4)* 88(PD7)* 89(PB3)* 90(PB4)* 96(PB9)* 97(PE0)* 98(PE1)*; U2 7(PG)*; U4 2(RESV)* 3(RESV)* 9(INT2/FSYNC/CLKIN)* 10(RESV)*; U16 1*; U18 7(PG)*; U19 3* 4*; U20 2* 3* 4* 7* 9*

## Notes on the sheet
- 引出接口
- WS2812B
- 12-5DCDC
- IMU
- tb6612
- 接口
- c
- b
- e
- icm42688
- OLED
- f407vgt6
- 12-3.3DCDC
- 蜂鸣器
- 调试口
- 开关
- EEPROM
